# Altium project DC Power and Motor Drive.PrjPcb
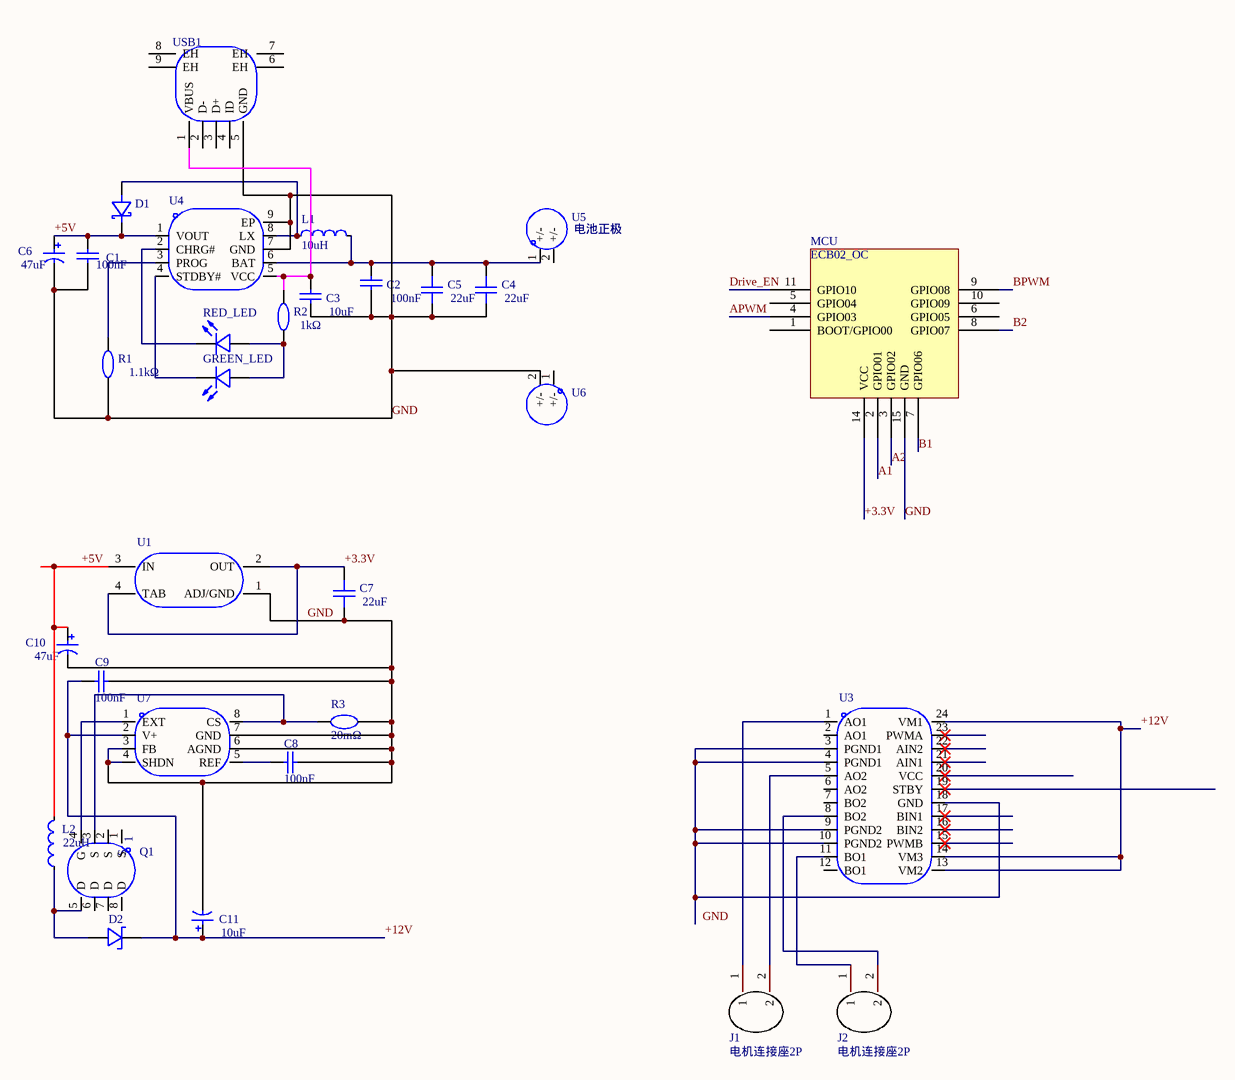
[diagram p0: sheet.schdoc]
1 sheet, 31 parts. Net scope: global (net labels, ports and power ports of the same name join across sheets).
Board file: PCB1.PcbDoc

## Sheet sheet.schdoc
size 434 x 309 mm; SheetNumber: 1; SheetTotal: 1

### Parts
C1  value 100nF  [C1206]
C2  value 100nF  [C1206]
C3  value 10uF  [C1206]
C4  value 22uF  [C1206]
C5  value 22uF  [C1206]
C6  value 47uF  [CAP-TH_BD5.0-P2.00-D0.8-FD]
C7  value 22uF  [C1206]
C8  value 100nF  [C1206]
C9  value 100nF  [C1206]
C10  value 47uF  [CAP-TH_BD5.0-P2.00-D0.8-FD]
C11  value 10uF  [CAP-TH_BD5.0-P2.00-D0.8-FD]
D1  (no value)  [SMA_L4.3-W2.6-LS5.1-RD]
D2  (no value)  [SOD-323_L1.8-W1.3-LS2.5-RD]
GREEN_LED  (no value)  [LED0805-R-RD]
J1  电机连接座2P  [电机连接座2P]
J2  电机连接座2P  [电机连接座2P]
L1  value 10uH  [IND-SMD_L4.4-W4.2]
L2  value 22uH  [IND-SMD_L6.0-W6.0_SWPA6045S]
MCU  ECB02_OC  [ECB02_OC]
Q1  NAME: S  NUMBER: 1  [SO-8_L4.9-W3.9-P1.27-LS5.9-BL]
R1  value 1.1kΩ  [R1206]
R2  value 1kΩ  [R1206]
R3  value 20mΩ  [R1206]
RED_LED  (no value)  [LED0805-RD_RED]
U1  (no value)  [TO-263-3L_L10.0-W9.2-P2.54-TL]
U3  (no value)  [SSOP-24_L8.4-W5.8-P0.65-LS7.8-BL]
U4  (no value)  [ESOP-8_L4.9-W3.9-P1.27-LS6.0-BL-EP]
U5  电池正极  [BAT-SMD_MY-18650-02]
U6  电池负极  [BAT-SMD_MY-18650-02]  (value not drawn)
U7  (no value)  [SO-8_L4.9-W3.9-P1.27-LS6.0-BL]
USB1  (no value)  [MICRO-USB-SMD_KH-MICRO-SMT.ZJ-5P]

### Nets
+3.3V: C7.2 MCU.14(VCC) U1.2(OUT) U1.4(TAB)
+5V: C1.2 C6.1 C10.1 D1.1 L2.2 U1.3(IN) U4.1(VOUT)
+12V: C9.2 C11.1 D2.1(C) U3.13(VM2) U3.14(VM3) U3.24(VM1) U7.2(V+)
A1: MCU.2(GPIO01)
A2: MCU.3(GPIO02)
APWM: MCU.4(GPIO03)
B1: MCU.7(GPIO06)
B2: MCU.8(GPIO07)
BPWM: MCU.9(GPIO08)
Drive_EN: MCU.11(GPIO10)
GND: C1.1 C2.1 C3.1 C4.1 C5.1 C6.2 C7.1 C8.1 C9.1 C10.2 C11.2 MCU.15(GND) R1.1 R3.2 U1.1(ADJ/GND) U4.7(GND) U4.9(EP) U6.2(+/-) U7.3(FB) U7.4(SHDN) U7.6(AGND) U7.7(GND) USB1.5(GND)
NetC2_2: C2.2 C4.2 C5.2 L1.2 U4.6(BAT) U5.1(+/-)
NetC3_2: C3.2 R2.2 U4.5(VCC) USB1.1(VBUS)
NetC8_2: C8.2 U7.5(REF)
NetD1_2: D1.2 L1.1 U4.8(LX)
NetD2_2: D2.2(A) L2.1 Q1.5(D)
NetGREEN_LED_1: GREEN_LED.1(A) R2.1 RED_LED.2(+)
NetGREEN_LED_2: GREEN_LED.2(K) U4.4(STDBY#)
NetJ1_1: J1.1 U3.1(AO1)
NetJ1_2: J1.2 U3.5(AO2)
NetJ2_1: J2.1 U3.11(BO1)
NetJ2_2: J2.2 U3.8(BO2)
NetQ1_3: Q1.3(S) R3.1 U7.8(CS)
NetQ1_4: Q1.4(G) U7.1(EXT)
NetR1_2: R1.2 U4.3(PROG)
NetRED_LED_1: RED_LED.1(-) U4.2(CHRG#)
NetU3_3: U3.3(PGND1) U3.4(PGND1) U3.9(PGND2) U3.10(PGND2) U3.18(GND)

Not connected (* = marked no-connect by the designer): MCU 1(BOOT/GPIO00) 5(GPIO04) 6(GPIO05) 10(GPIO09); Q1 1(S) 2(S) 6(D) 7(D) 8(D); U3 2(AO1) 6(AO2) 7(BO2) 12(BO1) 15(PWMB)* 16(BIN2)* 17(BIN1)* 19(STBY)* 20(VCC)* 21(AIN1)* 22(AIN2)* 23(PWMA)*; U5 2(+/-); U6 1(+/-); USB1 2(D-) 3(D+) 4(ID) 6(EH) 7(EH) 8(EH) 9(EH)

### Notes on the sheet
- Labels drawn without touching a wire or pin: GND

### Library data of the parts
C1 C2 C8 C9 = 1206B104K500NT: Manufacturer: FH(风华); Add into BOM: yes; Tolerance: ±10%; Voltage Rated: 50V; Temperature Coefficient: X7R; Symbol: 1206B104K500NT; Device: 1206B104K500NT; LCSC Part Name: 100nF ±10% 50V; Supplier Part: C110253; Manufacturer Part: 1206B104K500NT; Supplier Footprint: 1206; JLCPCB Part Class: Extended Part; Datasheet: https://atta.szlcsc.com/upload/public/pdf/source/20170923/C110253_1506149246670988311.pdf; Supplier: LCSC; Convert to PCB: yes
C3 = CL31B106KOHNNNE: Manufacturer: SAMSUNG(三星); Add into BOM: yes; Tolerance: ±10%; Voltage Rated: 16V; Temperature Coefficient: X7R; Symbol: CL31B106KOHNNNE; Device: CL31B106KOHNNNE; LCSC Part Name: 10uF ±10% 16V; Supplier Part: C47971; Manufacturer Part: CL31B106KOHNNNE; Supplier Footprint: 1206; JLCPCB Part Class: Extended Part; Datasheet: https://atta.szlcsc.com/upload/public/pdf/source/20160103/1457707729539.pdf; Supplier: LCSC; Convert to PCB: yes
C4 C5 C7 = CL31A226KOHNNNE: Manufacturer: SAMSUNG(三星); Add into BOM: yes; Temperature Coefficient: X5R; Tolerance: ±10%; Voltage Rated: 16V; Symbol: CL31A226KOHNNNE; Device: CL31A226KOHNNNE; LCSC Part Name: 22uF(226）±10% 16V; Supplier Part: C90146; Manufacturer Part: CL31A226KOHNNNE; Supplier Footprint: 1206; JLCPCB Part Class: Extended Part; Datasheet: https://atta.szlcsc.com/upload/public/pdf/source/20161228/1482890861309.pdf; Supplier: LCSC; Convert to PCB: yes
C6 C10 = 25YXF47MEFC5X11: Manufacturer: rubycon(红宝石); Add into BOM: yes; Lifetime @ Temp: 5000hrs 105; Equivalent Series Resistance(ESR): 900mΩ 100kHz; Ripple Current: 150mA 100kHz; φD: 5mm; Tolerance: ±20%; L: 11mm; Rated Voltage: 25V; Symbol: 25YXF47MEFC5X11; Device: 25YXF47MEFC5X11; LCSC Part Name: 47uF 25V; Supplier Part: C88724; Manufacturer Part: 25YXF47MEFC5X11; Supplier Footprint: 径向引线,5x11mm; JLCPCB Part Class: Extended Part; Datasheet: https://atta.szlcsc.com/upload/public/pdf/source/20161125/1480067870852.pdf; Supplier: LCSC; Convert to PCB: yes; Lead Spacing: 2mm; Operating Temperature: -
C11 = 50YXF10MEFC5X11: Manufacturer: rubycon(红宝石); Add into BOM: yes; Lifetime @ Temp: 5000hrs 105; Rated Voltage: 50V; Tolerance: ±20%; φD: 5mm; L: 11mm; Symbol: 50YXF10MEFC5X11; Device: 50YXF10MEFC5X11; LCSC Part Name: 10uF 50V; Supplier Part: C88726; Manufacturer Part: 50YXF10MEFC5X11; Supplier Footprint: 径向引线,5x11mm; JLCPCB Part Class: Extended Part; Datasheet: https://atta.szlcsc.com/upload/public/pdf/source/20161125/1480067871572.pdf; Supplier: LCSC; Convert to PCB: yes; Lead Spacing: 2mm; Operating Temperature: -
D1 = SS32_C5122584: Manufacturer: Slkor(萨科微); Manufacturer Part: SS32; Add into BOM: yes; Symbol: SS32_C5122584; Device: SS32_C5122584; LCSC Part Name: SS32; Supplier Part: C5122584; Supplier Footprint: SMA; JLCPCB Part Class: Extended Part; Datasheet: https://atta.szlcsc.com/upload/public/pdf/source/20220804/C2CBEEDC4A6687667FB4163A81F443B6.pdf; Supplier: LCSC; Convert to PCB: yes
D2 = 1N5819WS_C191023: Manufacturer: Hottech(合科泰); Add into BOM: yes; Reverse Voltage (Vr): 40V; Average Rectified Current (Io): 1A; Forward Voltage (Vf@If): 600mV@1A; Symbol: 1N5819WS; Device: 1N5819WS_C191023; LCSC Part Name: 40V 1A 600mV@1A; Supplier Part: C191023; Manufacturer Part: 1N5819WS; Supplier Footprint: SOD-323; JLCPCB Part Class: Basic Part; Datasheet: https://atta.szlcsc.com/upload/public/pdf/source/20180614/C191023_3C6A6398B911F3A4C23E7538EE054643.pdf; Supplier: LCSC; Convert to PCB: yes
GREEN_LED = NCD0805G1: Manufacturer: 国星光电; Symbol: FC-2012UGK-520D5; Add into BOM: yes; Emitted Color: 翠绿; Device: NCD0805G1; LCSC Part Name: 翠绿; Supplier Part: C84260; Manufacturer Part: NCD0805G1; Supplier Footprint: 0805; JLCPCB Part Class: Extended Part; Datasheet: https://atta.szlcsc.com/upload/public/pdf/source/20200820/C84260_AFC7BF57C6FBA034D182BB8D10A67EFE.pdf; Supplier: LCSC; Convert to PCB: yes
L1 = FXL0420-100-M: Manufacturer: cjiang(长江微电); Add into BOM: yes; Tolerance: ±20%; Rated Current: 1.6A; Saturation Current (Isat): 2.2A; DC Resistance (DCR): 256mΩ; Symbol: FXL0420-100-M; Device: FXL0420-100-M; LCSC Part Name: 10uh ±20% 1.6A 256mΩ; Supplier Part: C177242; Manufacturer Part: FXL0420-100-M; Supplier Footprint: SMD,0402; JLCPCB Part Class: Extended Part; Datasheet: https://atta.szlcsc.com/upload/public/pdf/source/20190322/C177242_7133EB0BD355D19A776CED3EC89322B8.pdf; Supplier: LCSC; Convert to PCB: yes
L2 = SWPA6045S220MT: Manufacturer: Sunlord(顺络); Add into BOM: yes; Tolerance: ±20%; Rated Current: 1.8A; DC Resistance (DCR): 89mΩ; Symbol: SWPA6045S220MT; Device: SWPA6045S220MT; LCSC Part Name: 22uH ±20% 1.8A 89mΩ; Supplier Part: C83454; Manufacturer Part: SWPA6045S220MT; Supplier Footprint: SMD; JLCPCB Part Class: Extended Part; Datasheet: https://atta.szlcsc.com/upload/public/pdf/source/20210916/AC798BA7E846B7D0B6818F45CD84DB0B.pdf; Supplier: LCSC; Convert to PCB: yes
Q1 = SI9410BDY-T1: Manufacturer: VBsemi(台湾微碧); Add into BOM: yes; Type: N沟道; Drain Source Voltage (Vdss): 20V; Continuous Drain Current (Id): 12A; Power Dissipation (Pd): 4.1W; Drain Source On Resistance (RDS(on)@Vgs,Id): 12mΩ@10V,10A; Gate Threshold Voltage (Vgs(th)@Id): 3V@250A; Symbol: SI9410BDY-T1; Device: SI9410BDY-T1; LCSC Part Name: N沟道 20V 12A; Supplier Part: C693120; Manufacturer Part: SI9410BDY-T1; Supplier Footprint: SO-8; JLCPCB Part Class: Extended Part; Datasheet: https://atta.szlcsc.com/upload/public/pdf/source/20200629/C693120_9442D1F62BD0C6EF38A6042147AFDDA4.pdf; Supplier: LCSC; Convert to PCB: yes
R1 = AECR1206F1K10K9: Manufacturer: RESI(开步睿思）; Add into BOM: yes; Tolerance: ±1%; Power(Watts): 250mW; Temperature Coefficient: ±100ppm/; Overload Voltage (Max): 200V; Symbol: AECR1206F1K10K9; Device: AECR1206F1K10K9; LCSC Part Name: 1.1kΩ ±1%; Supplier Part: C352136; Manufacturer Part: AECR1206F1K10K9; Supplier Footprint: 1206; JLCPCB Part Class: Extended Part; Datasheet: https://atta.szlcsc.com/upload/public/pdf/source/20181212/C352136_D341163928B058579362732989CD352F.pdf; Supplier: LCSC; Convert to PCB: yes; Type: 厚膜电阻; Operating Temperature Range: -55~+125
R2 = 1206W4J0102T5E: Manufacturer: UNI-ROYAL(厚声); Add into BOM: yes; Tolerance: ±5%; Power(Watts): 250mW; Temperature Coefficient: ±100ppm/; Overload Voltage (Max): 200V; Symbol: 1206W4J0102T5E; Device: 1206W4J0102T5E; LCSC Part Name: 1kΩ ±5%; Supplier Part: C1469; Manufacturer Part: 1206W4J0102T5E; Supplier Footprint: 1206; JLCPCB Part Class: Extended Part; Datasheet: https://atta.szlcsc.com/upload/public/pdf/source/20200306/C422600_1E6D84923E4A46A82E41ADD87F860B5C.pdf; Supplier: LCSC; Convert to PCB: yes; Type: 厚膜电阻; Operating Temperature Range: -55~+155
R3 = 1206W3F200MT5E: Manufacturer: UNI-ROYAL(厚声); Add into BOM: yes; Tolerance: ±1%; Power(Watts): 1/3W; Temperature Coefficient: ±1000ppm/; Overload Voltage (Max): 200V; Symbol: 1206W3F200MT5E; Device: 1206W3F200MT5E; LCSC Part Name: 20mΩ ±1%; Supplier Part: C2765435; Manufacturer Part: 1206W3F200MT5E; Supplier Footprint: 1206; JLCPCB Part Class: Extended Part; Datasheet: https://atta.szlcsc.com/upload/public/pdf/source/20200306/C422600_1E6D84923E4A46A82E41ADD87F860B5C.pdf; Supplier: LCSC; Convert to PCB: yes; Type: 厚膜电阻; Operating Temperature Range: -55~+155
RED_LED = NCD0805R1: Manufacturer: 国星光电; Symbol: FC-2012HRK-620D; Add into BOM: yes; Emitted Color: 红灯; Device: NCD0805R1; LCSC Part Name: 红灯; Supplier Part: C84256; Manufacturer Part: NCD0805R1; Supplier Footprint: 0805; JLCPCB Part Class: Basic Part; Datasheet: https://atta.szlcsc.com/upload/public/pdf/source/20200820/C84256_F0A75A43B3EAD75808600A0514C76B99.pdf; Supplier: LCSC; Convert to PCB: yes
U1 = LM1085R-3.3: Manufacturer: HTC; Add into BOM: yes; Output Type: 固定; Output Polarity: 正; Number of Outputs: 1; Maximum Input Voltage: 12V; Output Voltage: 3.3V; Dropout Voltage: 1.5V@(3A); Output Current: 3A; Symbol: LM1085R-3.3; Device: LM1085R-3.3; LCSC Part Name: Vin=12V Vout=3.3V 3A; Supplier Part: C126016; Manufacturer Part: LM1085R-3.3; Supplier Footprint: TO-263-3; JLCPCB Part Class: Extended Part; Datasheet: https://atta.szlcsc.com/upload/public/pdf/source/20170814/C126016_1502678369734885888.pdf; Supplier: LCSC; Convert to PCB: yes; Power Supply Rejection Ratio (PRSS): -
U3 = TB6612FNG(O,C,8,EL: Manufacturer: TOSHIBA(东芝); Add into BOM: yes; Symbol: TB6612FNG(O,C,8,EL; Device: TB6612FNG(O,C,8,EL; LCSC Part Name: TB6612FNG(O,C,8,EL; Supplier Part: C88224; Manufacturer Part: TB6612FNG(O,C,8,EL; Supplier Footprint: SSOP-24_208mil; JLCPCB Part Class: Extended Part; Datasheet: https://atta.szlcsc.com/upload/public/pdf/source/20170412/1491969113864.pdf; Supplier: LCSC; Convert to PCB: yes
U4 = TP5400: Manufacturer: TOPPOWER(南京拓微); Symbol: TP5400_C2891434; Add into BOM: yes; Device: TP5400; LCSC Part Name: TP5400; Supplier Part: C2891434; Manufacturer Part: TP5400; Supplier Footprint: ESOP-8; JLCPCB Part Class: Extended Part; Datasheet: https://atta.szlcsc.com/upload/public/pdf/source/20210909/352D9D40D77A1DD73F7904E364EF004B.pdf; Supplier: LCSC; Convert to PCB: yes
U5 U6 = MY-18650-02: Manufacturer: MYOUNG(美阳); Add into BOM: yes; Symbol: MY-18650-02; Device: MY-18650-02; LCSC Part Name: 18650电池夹; Supplier Part: C2979182; Manufacturer Part: MY-18650-02; Supplier Footprint: SMD; JLCPCB Part Class: Extended Part; Datasheet: https://atta.szlcsc.com/upload/public/pdf/source/20220302/C8C484F04049224A79B93DF7FB83EA3E.pdf; Supplier: LCSC; Convert to PCB: yes
  U5: Name: 电池正极
  U6: Name: 电池负极
U7 = MAX1771ESA+T: Manufacturer: MAXIM(美信); Add into BOM: yes; Function: 升降压型; Synchronous Rectification: 否; Number of Outputs: 1; Topology: 升降压式；升压式; Input Voltage: 3V~16.5V; Switching Frequency: 300kHz; Duty Cycle (Max): 92%; Symbol: MAX1771ESA+T; Device: MAX1771ESA+T; LCSC Part Name: 升降压型 3V~16.5V 300kHz; Supplier Part: C407903; Manufacturer Part: MAX1771ESA+T; Supplier Footprint: SO-8; JLCPCB Part Class: Extended Part; Datasheet: https://atta.szlcsc.com/upload/public/pdf/source/20190725/C407903_D57A782B028863ED6FB84B5C72F3E59A.pdf; Supplier: LCSC; Convert to PCB: yes; Operating Temperature: -40~+85@(TA)
USB1 = KH-MICRO-SMT.ZJ-5P: Manufacturer: kinghelm(金航标); Add into BOM: yes; Connector Type: Micro-B; Gender: 母座; Number of Contacts: 5; Number of Ports: 1; Symbol: KH-MICRO-SMT.ZJ-5P; Device: KH-MICRO-SMT.ZJ-5P; LCSC Part Name: Micro-B 母座 卧贴; Supplier Part: C2688803; Manufacturer Part: KH-MICRO-SMT.ZJ-5P; Supplier Footprint: SMD; JLCPCB Part Class: Extended Part; Datasheet: https://atta.szlcsc.com/upload/public/pdf/source/20210202/C2688803_645B8B57EA53555BCB25BD27C52ECCFB.pdf; Supplier: LCSC; Convert to PCB: yes; Standard: USB 2.0; Mounting Style: 卧贴; Current Rating - Power (Max): -; Operating Temperature Range: -30~+80